# Altium project SignalAnalysis_final.PrjPCB
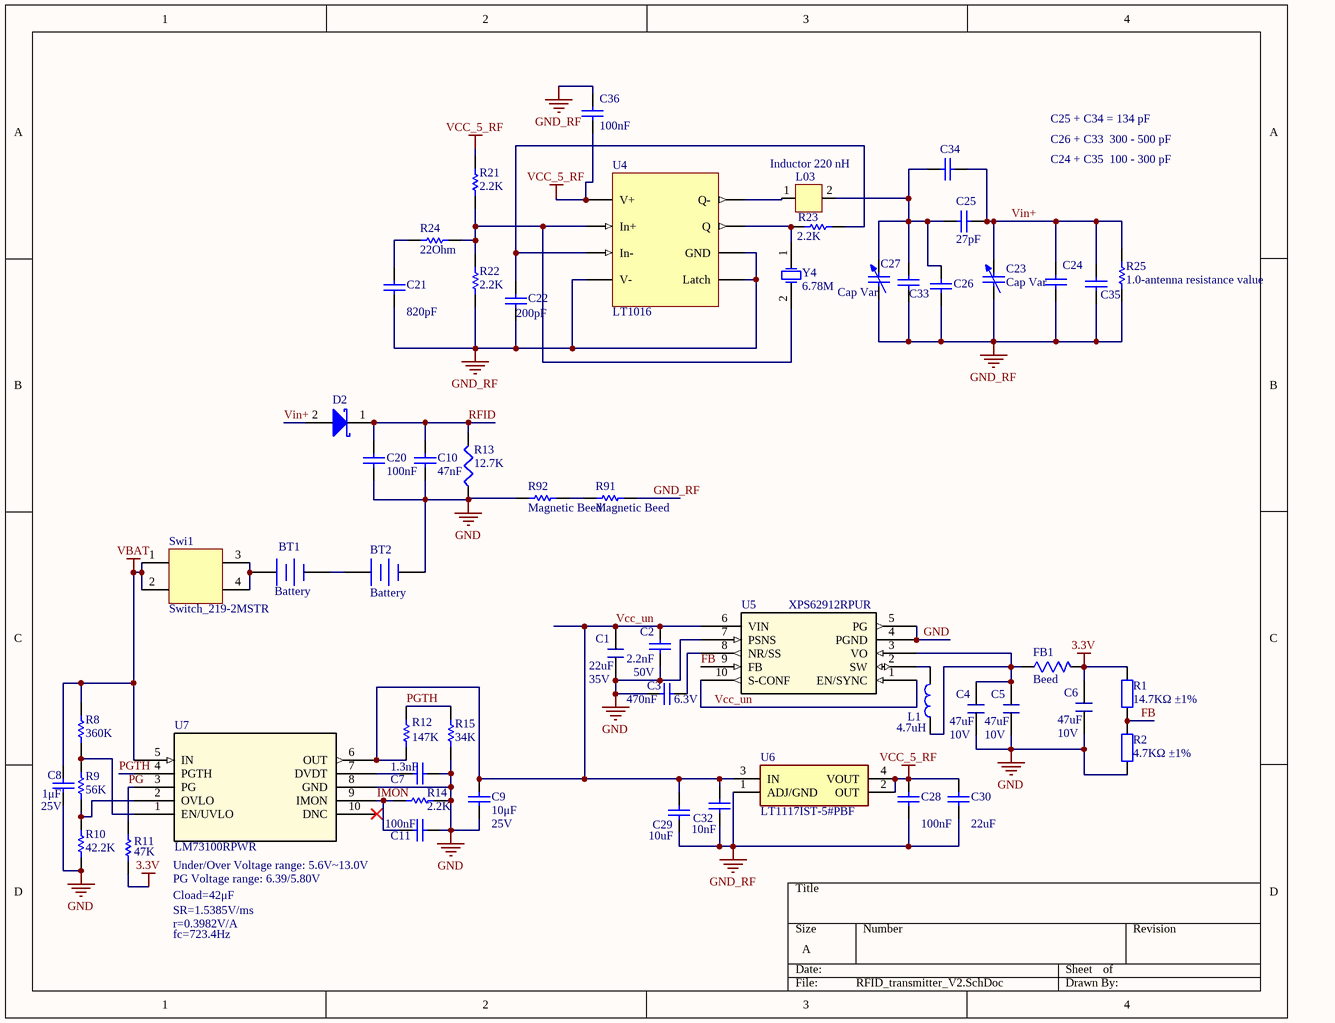
[diagram p0: RFID_transmitter_V2.SchDoc]
2 sheets, 103 parts. Net scope: global (net labels, ports and power ports of the same name join across sheets).
Board file: SignalAnalyse.PcbDoc
Sheets:
  RFID_transmitter_V2.SchDoc
  SignalAnalyse.SchDoc

## Sheet RFID_transmitter_V2.SchDoc
size A

### Parts
BT1  Battery  [Battery]
BT2  Battery  [Battery]
C1  value 22uF  Voltage: 35V  [C0805]  (hidden comment: Multilayer Ceramic Capacitor)
C2  value 2.2nF  Voltage: 50V  [0402]  (hidden comment: Cap Semi)
C3  value 470nF  Voltage: 6.3V  [1608[0603]]  (hidden comment: Cap Semi)
C4  value 47uF  Voltage: 10V  [C0805]  (hidden comment: Multilayer Ceramic Capacitor)
C5  value 47uF  Voltage: 10V  [C0805]  (hidden comment: Multilayer Ceramic Capacitor)
C6  value 47uF  Voltage: 10V  [C0805]  (hidden comment: Multilayer Ceramic Capacitor)
C7  value 1.3nF  [0402]  (hidden comment: Cap Semi)
C8  value 1μF  Voltage: 25V  [0603]  (hidden comment: Cap Semi)
C9  value 10μF  Voltage: 25V  [0603]  (hidden comment: Cap Semi)
C10  value 47nF  [0603]  (hidden comment: Cap 100n)
C11  value 100nF  [0402]  (hidden comment: Cap Semi)
C20  value 100nF  [0603]  (hidden comment: Cap 100n)
C21  value 820pF  [0603]  (hidden comment: Cap 820p)
C22  value 200pF  [0603]  (hidden comment: Cap 200p)
C23  Cap Var  [Variable_Capacitor_JZ400HV1]
C24  Cap  [0603]  (value not drawn)
C25  value 27pF  [0603]  (hidden comment: Cap)
C26  random value needs carefully address  [0603]  (value not drawn)
C27  Cap Var  [Variable_Capacitor_JZ400HV1]
C28  value 100nF  [0603]  (hidden comment: Cap 100nF)
C29  value 10uF  [0603]  (hidden comment: Cap 10u)
C30  value 22uF  [0603]  (hidden comment: Cap 22u)
C32  value 10nF  [0603]  (hidden comment: Cap 10n)
C33  random value needs carefully address  [0603]  (value not drawn)
C34  Cap  [0603]  (value not drawn)
C35  Cap  [0603]  (value not drawn)
C36  value 100nF  [C1210]  (hidden comment: C3225C0G1H104JT000N)
D2  Diode  [SOD3716X135N]  (value not drawn)
FB1  Beed  [BEADC2012X110N]
L1  value 4.7uH  [XGL4030]  (hidden comment: XGL4030)
L03  Inductor 220 nH  [Ferrite_bead_0805inch_2012mm]
R1  14.7KΩ ±1%  [LC-0402_R]
R2  4.7KΩ ±1%  [LC-0402_R]
R8  value 360K  [0402-A]  (hidden comment: Res 2.2KΩ ±1%)
R9  value 56K  [0402-A]  (hidden comment: Res 2.2KΩ ±1%)
R10  value 42.2K  [0402-A]  (hidden comment: Res 2.2KΩ ±1%)
R11  value 47K  [0402-A]  (hidden comment: Res 2.2KΩ ±1%)
R12  value 147K  [0402-A]  (hidden comment: Res 2.2KΩ ±1%)
R13  value 12.7K  [J1-0603]  (hidden comment: Res 12.7KΩ ±1%)
R14  value 2.2K  [0402-A]  (hidden comment: Res 2.2KΩ ±1%)
R15  value 34K  [0402-A]  (hidden comment: Res 2.2KΩ ±1%)
R21  value 2.2K  [J1-0603]  (hidden comment: Res 2.2KΩ ±1%)
R22  value 2.2K  [J1-0603]  (hidden comment: Res 2.2KΩ ±1%)
R23  value 2.2K  [J1-0603]  (hidden comment: Res 2.2KΩ ±1%)
R24  value 22Ohm  [J1-0603]  (hidden comment: Res 2.2KΩ ±1%)
R25  value 1.0-antenna resistance value  [J1-0603]  (hidden comment: Res 2.2KΩ ±1%)
R91  Magnetic Beed  [0603]
R92  Magnetic Beed  [0603]
Swi1  Switch_219-2MSTR  [Switch_219-2MSTR]
U4  LT1016  [LT1016_SOIC]
U5  XPS62912RPUR  [VQFN-HR10_RPU_TEX]
U6  LT1117IST-5#PBF  [SOT230P700X180-4N]
U7  LM73100RPWR  [VQFN-HR-10_2X2_TEX]
Y4  Frequency: 6.78M  [HC-49SMD]  (hidden comment: CRYSTAL)

### Nets
3.3V: C6.2 FB1.2 R1.2 R11.1
GND: BT2.2(-) C1.1 C2.1 C3.1 C4.1 C5.1 C6.1 C7.1 C8.1 C9.1 C10.2 C11.1 C20.2 R2.1 R10.1 R13.1 R14.1 R15.1 R92.2 U5.4(PGND) U5.5(PG) U5.7(PSNS) U7.8(GND)
GND_RF: C21.1 C22.1 C23.1 C24.1 C26.2 C27.1 C28.1 C29.1 C30.1 C32.1 C33.2 C35.1 C36.2 R22.1 R25.2 R91.1 U4.4(V-) U4.5(Latch) U4.6(GND) U6.1(ADJ/GND)
VBAT: C8.2 R8.2 Swi1.1(In1) Swi1.2(In2) U7.5(IN)
VCC_5_RF: C28.2 C30.2 C36.1 R21.2 U4.1(V+) U6.2(OUT) U6.4(VOUT)
FB: R1.1 R2.2 U5.9(FB)
IMON: C11.2 R14.2 U7.9(IMON)
PG: R11.2 U7.3(PG)
PGTH: R12.2 R15.2 U7.4(PGTH)
RFID: C10.1 C20.1 D2.1(ANODE) R13.2
Vcc_un: C1.2 C2.2 C9.2 C29.2 C32.2 R12.1 U5.1(EN/SYNC) U5.6(VIN) U5.10(S-CONF) U6.3(IN) U7.6(OUT)
Vin+: C23.2 C24.2 C25.1 C34.1 C35.2 D2.2(CATHODE) R25.1
NetBT1_1: BT1.1(+) Swi1.3(Out1) Swi1.4(Out2)
NetBT1_2: BT1.2(-) BT2.1(+)
NetC3_2: C3.2 U5.8(NR/SS)
NetC4_2: C4.2 C5.2 FB1.1 L1.1 U5.3(VO)
NetC7_2: C7.2 U7.7(DVDT)
NetC21_2: C21.2 R24.2
NetC22_2: C22.2 R23.1 U4.3(In-)
NetC25_2: C25.2 C26.1 C27.2 C33.1 C34.2 L03.2
NetL1_2: L1.2 U5.2(SW)
NetL03_1: L03.1 U4.8(Q-)
NetR8_1: R8.1 R9.2 U7.1(EN/UVLO)
NetR9_1: R9.1 R10.2 U7.2(OVLO)
NetR21_1: R21.1 R22.2 R24.1 U4.2(In+) Y4.2(OSC2)
NetR23_2: R23.2 U4.7(Q) Y4.1(OSC1)
NetR91_2: R91.2 R92.1

Not connected (* = marked no-connect by the designer): U7 10(DNC)*

### Notes on the sheet
- C25 + C34 = 134 pF
- C26 + C33  300 - 500 pF
- C24 + C35  100 - 300 pF
- Cload=42μF
- Under/Over Voltage range: 5.6V~13.0V
- PG Voltage range: 6.39/5.80V
- r=0.3982V/A
- fc=723.4Hz
- SR=1.5385V/ms

### Library data of the parts
BT1 BT2 = Battery: Multicell Battery; Published: 24-Mar-1999; LatestRevisionDate: 17-Jul-2002; LatestRevisionNote: Re-released for DXP Platform.; PackageReference: BAT-2; Publisher: Altium Limited; PackageDescription: Battery; 2 Leads
C1 = C-Ceramic: Part Number: C2012X5R1V226M125AC; Manufacturer: TDK
C2 = Cap Semi: Capacitor (Semiconductor SIM Model); Part Number: GRM155R71H222KA01D; Manufacturer: MuRata; Published: 8-Jun-2000; LatestRevisionDate: 29-May-2009; LatestRevisionNote: IPC-7351 Footprint Added.; PackageReference: C1206; Publisher: Altium Limited; PackageDescription: Chip Capacitor
C3 = Cap Semi: Capacitor (Semiconductor SIM Model); Manufacturer: MuRata; Part Number: GRM188R60J474KA01D; Published: 8-Jun-2000; LatestRevisionDate: 29-May-2009; LatestRevisionNote: IPC-7351 Footprint Added.; PackageReference: C1206; Publisher: Altium Limited; PackageDescription: Chip Capacitor
C4-C6 = C-Ceramic: Part Number: C2012X5R1A476M125AC; Manufacturer: TDK
C7 = Cap Semi: 多层陶瓷电容器MLCC - SMD/SMT 1.3nF 50VDC X7R 5% 0402; Part Number: GRM155R71H132JA01D; Manufacturer: MuRata; Voltage: 50V; Published: 8-Jun-2000; LatestRevisionDate: 29-May-2009; LatestRevisionNote: IPC-7351 Footprint Added.; PackageReference: C1206; Publisher: Altium Limited; PackageDescription: Chip Capacitor
C8 = Cap Semi: 多层陶瓷电容器MLCC - SMD/SMT 0603 1uF 25V X6S 10%; Manufacturer: MuRata; Part Number: GRM188C81E105KAADD; Published: 8-Jun-2000; LatestRevisionDate: 29-May-2009; LatestRevisionNote: IPC-7351 Footprint Added.; PackageReference: C1206; Publisher: Altium Limited; PackageDescription: Chip Capacitor
C9 = Cap Semi: 多层陶瓷电容器MLCC - SMD/SMT 10UF 25V 10% 0603; Manufacturer: MuRata; Part Number: GRM188R61E106KA73D; Published: 8-Jun-2000; LatestRevisionDate: 29-May-2009; LatestRevisionNote: IPC-7351 Footprint Added.; PackageReference: C1206; Publisher: Altium Limited; PackageDescription: Chip Capacitor
C10 = Cap Semi: Capacitor; Part Number: CL10B473KB8NNNC; Manufacturer: SAMSUNG; Voltage: 50V; Published: 8-Jun-2000; LatestRevisionDate: 29-May-2009; LatestRevisionNote: IPC-7351 Footprint Added.; PackageReference: C1206; Publisher: Altium Limited; PackageDescription: Chip Capacitor
C11 = Cap Semi: 多层陶瓷电容器MLCC - SMD/SMT 100nF 10VDC X5R 5% 0402; Part Number: GRM155R61A104JA01D; Manufacturer: MuRata; Voltage: 10V; Published: 8-Jun-2000; LatestRevisionDate: 29-May-2009; LatestRevisionNote: IPC-7351 Footprint Added.; PackageReference: C1206; Publisher: Altium Limited; PackageDescription: Chip Capacitor
C20 = Cap Semi: Capacitor; Part Number: CL10B104KB8NNNC; Manufacturer: SAMSUNG; Voltage: 50V; Published: 8-Jun-2000; LatestRevisionDate: 29-May-2009; LatestRevisionNote: IPC-7351 Footprint Added.; PackageReference: C1206; Publisher: Altium Limited; PackageDescription: Chip Capacitor
C21 C22 C30 C32 = Cap: Capacitor; Published: 8-Jun-2000; LatestRevisionDate: 17-Jul-2002; LatestRevisionNote: Re-released for DXP Platform.; PackageReference: RAD-0.3; Publisher: Altium Limited; PackageDescription: Radial Cap, Thru-Hole; 2 Leads; 0.3 in Pin Spacing
C23 C27 = Cap Var: Variable or Adjustable Capacitor; Value: 100pF; Published: 24-Mar-1999; LatestRevisionDate: 29-May-2009; LatestRevisionNote: IPC-7351 Footprint Added.; PackageReference: C1210; Publisher: Altium Limited; PackageDescription: Chip Capacitor 1210 Case Size; Code_JEITA: 1210; Code_IPC: CAPC3225
C24 = Cap: Capacitor_for resonance; Value: 22pF; Published: 8-Jun-2000; LatestRevisionDate: 17-Jul-2002; LatestRevisionNote: Re-released for DXP Platform.; PackageReference: RAD-0.3; Publisher: Altium Limited; PackageDescription: Radial Cap, Thru-Hole; 2 Leads; 0.3 in Pin Spacing
C25 = Cap: Capacitor_for resonance; Published: 8-Jun-2000; LatestRevisionDate: 17-Jul-2002; LatestRevisionNote: Re-released for DXP Platform.; PackageReference: RAD-0.3; Publisher: Altium Limited; PackageDescription: Radial Cap, Thru-Hole; 2 Leads; 0.3 in Pin Spacing
C26 = Cap: Capacitor_for resonance; Value: 470pF; Published: 8-Jun-2000; LatestRevisionDate: 17-Jul-2002; LatestRevisionNote: Re-released for DXP Platform.; PackageReference: RAD-0.3; Publisher: Altium Limited; PackageDescription: Radial Cap, Thru-Hole; 2 Leads; 0.3 in Pin Spacing
C28 = Cap: 多层陶瓷电容器MLCC - SMD/SMT 0.1UF 16V 10% 0603; Part Number: GCM188R71C104KA37J; Published: 8-Jun-2000; LatestRevisionDate: 17-Jul-2002; LatestRevisionNote: Re-released for DXP Platform.; PackageReference: RAD-0.3; Publisher: Altium Limited; PackageDescription: Radial Cap, Thru-Hole; 2 Leads; 0.3 in Pin Spacing; Voltage: 16V
C29 = Cap: Capacitor; Part Number: GRM188R61E106KA73D; Manufacturer: Murata; Voltage: 25V; Published: 8-Jun-2000; LatestRevisionDate: 17-Jul-2002; LatestRevisionNote: Re-released for DXP Platform.; PackageReference: RAD-0.3; Publisher: Altium Limited; PackageDescription: Radial Cap, Thru-Hole; 2 Leads; 0.3 in Pin Spacing
C33-C35 = Cap: Capacitor_for resonance; Value: 1pF; Published: 8-Jun-2000; LatestRevisionDate: 17-Jul-2002; LatestRevisionNote: Re-released for DXP Platform.; PackageReference: RAD-0.3; Publisher: Altium Limited; PackageDescription: Radial Cap, Thru-Hole; 2 Leads; 0.3 in Pin Spacing
C36 = Cap Semi: Capacitor (Semiconductor SIM Model); Manufacturer: TDK; Voltage: 10V; Published: 8-Jun-2000; LatestRevisionDate: 29-May-2009; LatestRevisionNote: IPC-7351 Footprint Added.; PackageReference: C1206; Publisher: Altium Limited; PackageDescription: Chip Capacitor; Part Number: C3225C0G1H104JT000N
D2 = MBR0540T1G: Surface Mount Schottky Power Rectifier; Manufacturer_Name: ON Semiconductor; Datasheet Link: http://www.onsemi.com/pub/Collateral/MBR0540T1-D.PDF; Height: 1.35mm; Manufacturer_Part_Number: MBR0540T1G; Arrow Part Number: MBR0540T1G; Arrow Price/Stock: https://www.arrow.com/en/products/mbr0540t1g/on-semiconductor; Mouser Part Number: 863-MBR0540T1G; Mouser Price/Stock: https://www.mouser.co.uk/ProductDetail/ON-Semiconductor/MBR0540T1G?qs=3JMERSakebqeY0cO5%252BUPCQ%3D%3D
FB1 = 782853200: Wurth Ferrite Bead; Manufacturer_Name: Wurth Elektronik; Datasheet Link: http://katalog.we-online.de/pbs/datasheet/782853200.pdf; Height: 1.1mm; Manufacturer_Part_Number: 782853200
L1 = Inductor: Coilcraft Shielded Power Inductors; Part Number: XGL4030-472MEC; Manufacturer: Coilcraft
L03 = Component_1: 220nH
R1 = 0402 1KΩ (1001) 1%: 贴片电阻; Part Number: CRCW040214K7FKED; Manufacturer: Vishay-Dale; ComponentLink1Description: 供应商链接; ComponentLink1URL: http://www.szlcsc.com/product/details_12256.html; Package: 0402
R2 = 0402 1KΩ (1001) 1%: 贴片电阻; Part Number: CRCW04024K70FKED; Manufacturers: Vishay-Dale; ComponentLink1Description: 供应商链接; ComponentLink1URL: http://www.szlcsc.com/product/details_12256.html; Package: 0402
R8 = Res1: Resistor; Part Number: RC0402FR-07360KL; Manufacturer: YAGEO; Published: 8-Jun-2000; LatestRevisionDate: 17-Jul-2002; LatestRevisionNote: Re-released for DXP Platform.; PackageReference: AXIAL-0.3; Publisher: Altium Limited; PackageDescription: Axial Device, Thru-Hole; 2 Leads; 0.3 in Pin Spacing
R9 = Res1: Resistor; Part Number: RC0402FR-0756KL; Manufacturer: YAGEO; Published: 8-Jun-2000; LatestRevisionDate: 17-Jul-2002; LatestRevisionNote: Re-released for DXP Platform.; PackageReference: AXIAL-0.3; Publisher: Altium Limited; PackageDescription: Axial Device, Thru-Hole; 2 Leads; 0.3 in Pin Spacing
R10 R21-R23 = Res1: Resistor; Part Number: RC0603FR-072K2L; Manufacturer: YAGEO; Published: 8-Jun-2000; LatestRevisionDate: 17-Jul-2002; LatestRevisionNote: Re-released for DXP Platform.; PackageReference: AXIAL-0.3; Publisher: Altium Limited; PackageDescription: Axial Device, Thru-Hole; 2 Leads; 0.3 in Pin Spacing
R11 = Res1: Resistor; Part Number: RC0402FR-0747KL; Manufacturer: YAGEO; Published: 8-Jun-2000; LatestRevisionDate: 17-Jul-2002; LatestRevisionNote: Re-released for DXP Platform.; PackageReference: AXIAL-0.3; Publisher: Altium Limited; PackageDescription: Axial Device, Thru-Hole; 2 Leads; 0.3 in Pin Spacing
R12 = Res1: Resistor; Part Number: RC0402FR-07147KL; Manufacturer: YAGEO; Published: 8-Jun-2000; LatestRevisionDate: 17-Jul-2002; LatestRevisionNote: Re-released for DXP Platform.; PackageReference: AXIAL-0.3; Publisher: Altium Limited; PackageDescription: Axial Device, Thru-Hole; 2 Leads; 0.3 in Pin Spacing
R13 = Res3: Resistor; Part Number: RC0603FR-0712K7L; Manufacturer: YAGEO; Published: 8-Jun-2000; LatestRevisionDate: 29-May-2009; LatestRevisionNote: IPC-7351 Footprint Added.; PackageReference: J1-0603; Publisher: Altium Limited; PackageDescription: Chip Resistor
R14 = Res1: Resistor; Part Number: RC0402FR-072K2L; Manufacturer: YAGEO; Published: 8-Jun-2000; LatestRevisionDate: 17-Jul-2002; LatestRevisionNote: Re-released for DXP Platform.; PackageReference: AXIAL-0.3; Publisher: Altium Limited; PackageDescription: Axial Device, Thru-Hole; 2 Leads; 0.3 in Pin Spacing
R15 = Res1: Resistor; Part Number: RC0402FR-0734KL; Manufacturer: YAGEO; Published: 8-Jun-2000; LatestRevisionDate: 17-Jul-2002; LatestRevisionNote: Re-released for DXP Platform.; PackageReference: AXIAL-0.3; Publisher: Altium Limited; PackageDescription: Axial Device, Thru-Hole; 2 Leads; 0.3 in Pin Spacing
R24 = Res1: Resistor; Part Number: RC0603FR-0722RL; Manufacturer: YAGEO; Published: 8-Jun-2000; LatestRevisionDate: 17-Jul-2002; LatestRevisionNote: Re-released for DXP Platform.; PackageReference: AXIAL-0.3; Publisher: Altium Limited; PackageDescription: Axial Device, Thru-Hole; 2 Leads; 0.3 in Pin Spacing
R25 = Res1: Resistor; Part Number: RC0603FR-071RL; Manufacturer: YAGEO; Published: 8-Jun-2000; LatestRevisionDate: 17-Jul-2002; LatestRevisionNote: Re-released for DXP Platform.; PackageReference: AXIAL-0.3; Publisher: Altium Limited; PackageDescription: Axial Device, Thru-Hole; 2 Leads; 0.3 in Pin Spacing
R91 R92 = Res1: Wurth Magnetic Bead; Value: 0; Published: 8-Jun-2000; LatestRevisionDate: 17-Jul-2002; LatestRevisionNote: Re-released for DXP Platform.; PackageReference: AXIAL-0.3; Publisher: Altium Limited; PackageDescription: Axial Device, Thru-Hole; 2 Leads; 0.3 in Pin Spacing
U5 = XPS62912RPUR: No Description Available; Vendor: Texas Instruments; Built_By: EMA_Cory; SourceLibrary: TI_2020-08-27; Datasheet: https://www.ti.com/lit/ds/symlink/tps62913.pdf?ts=1598546293590&ref_url=https%253A%252F%252Fwww.ti.com%252Fproduct%252FTPS62913; Manufacturer_Part_Number: XPS62912RPUR; Copyright: Copyright (C) 2018 Accelerated Designs. All rights reserved; RefDes: RefDes; Type: DEV
U7 = LM73100RPWR: No Description Available; Vendor: Texas Instruments; Built_By: EMA_Anthony; SourceLibrary: Add_to_database_2020-10-23; Datasheet: https://www.ti.com/lit/ds/symlink/lm7310.pdf?ts=1603393347029&ref_url=https%253A%252F%252Fwww.ti.com%252Fproduct%252FLM7310%253FHQS%253DTI-null-null-octopart-df-pf-null-wwe; Manufacturer_Part_Number: LM73100RPWR; Copyright: Copyright (C) 2018 Accelerated Designs. All rights reserved; RefDes: RefDes; Type: DEV
Y4 = CRYSTAL: Industry standard SMD crystal; Part Number: LFXTAL057410Bulk; Manufacturer: IQD

## Sheet SignalAnalyse.SchDoc
size A4
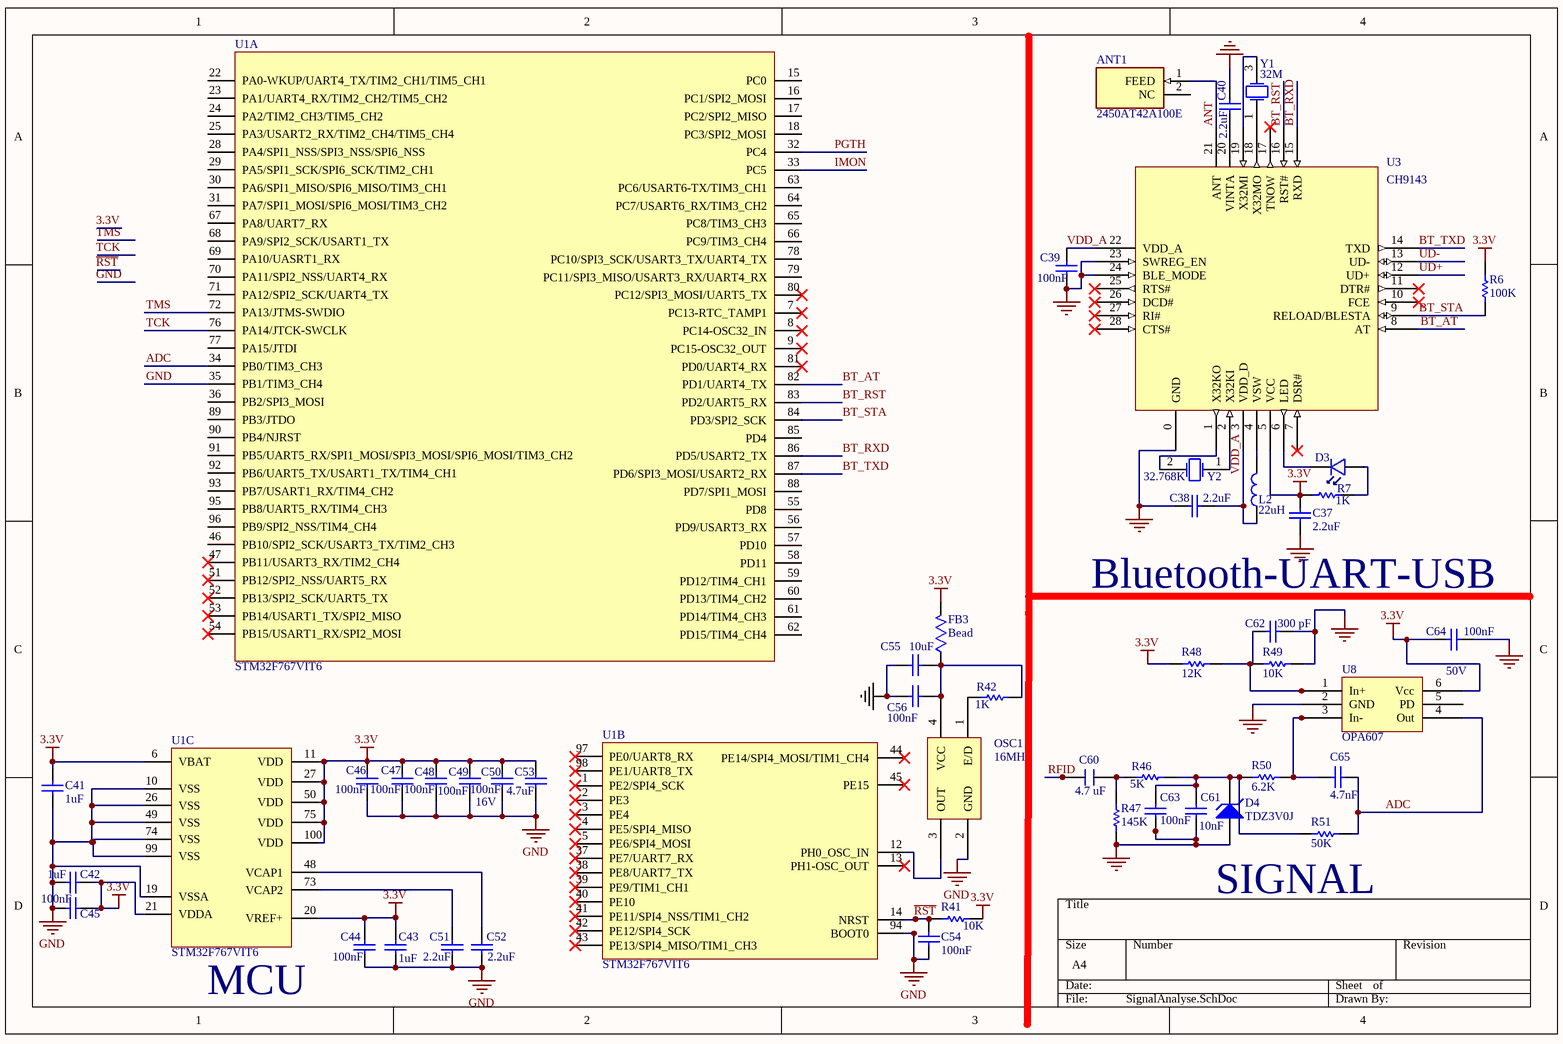
[diagram p1: SignalAnalyse.SchDoc]

### Parts
ANT1  2450AT42A100E  [ANTC5020X110N]
C37  value 2.2uF  [0603]  (hidden comment: GRM188R61A226ME15D)
C38  value 2.2uF  [0603]  (hidden comment: GRM188R61A226ME15D)
C39  value 100nF  [1608[0603]]  (hidden comment: Cap 100nF)
C40  value 2.2uF  [1608[0603]]  (hidden comment: GRM188R61A226ME15D)
C41  value 1uF  [1608[0603]]  (hidden comment: GRM188R61A226ME15D)
C42  value 1uF  [1608[0603]]  (hidden comment: GRM188R61A226ME15D)
C43  value 1uF  [1608[0603]]  (hidden comment: GRM188R61A226ME15D)
C44  value 100nF  [1608[0603]]  (hidden comment: Cap 100nF)
C45  value 100nF  [1608[0603]]  (hidden comment: Cap 100nF)
C46  value 100nF  [1608[0603]]  (hidden comment: Cap 100nF)
C47  value 100nF  [1608[0603]]  (hidden comment: Cap 100nF)
C48  value 100nF  [1608[0603]]  (hidden comment: Cap 100nF)
C49  value 100nF  [1608[0603]]  (hidden comment: Cap 100nF)
C50  value 100nF  Voltage: 16V  [1608[0603]]  (hidden comment: Cap 100nF)
C51  value 2.2uF  [1608[0603]]  (hidden comment: GRM188R61A226ME15D)
C52  value 2.2uF  [1608[0603]]  (hidden comment: GRM188R61A226ME15D)
C53  value 4.7uF  [1608[0603]]  (hidden comment: GRM188R61A226ME15D)
C54  value 100nF  [1608[0603]]  (hidden comment: Cap 100nF)
C55  value 10uF  [1608[0603]]  (hidden comment: Cap 10μF)
C56  value 100nF  [1608[0603]]  (hidden comment: Cap 100nF)
C60  value 4.7 uF  [0603]  (hidden comment: Cap 4.7μF)
C61  value 10nF  [1608[0603]]  (hidden comment: Cap 10n)
C62  value 300 pF  [1608[0603]]  (hidden comment: Cap 300pF)
C63  value 100nF  [1608[0603]]  (hidden comment: Cap 100nF)
C64  value 100nF  Voltage: 50V  [1608[0603]]  (hidden comment: Cap 100nF)
C65  value 4.7nF  [1608[0603]]  (hidden comment: Cap 4.7nF)
D3  LED-Green  [D0805]  (value not drawn)
D4  TDZ3V0J  [SOD-323]
FB3  Bead  [BEADC2012X110N]
L2  22uH  [L0805]
OSC1  16MHz  [OSC_3.2X2.5]
R6  value 100K  [J1-0603]  (hidden comment: Res 2.2KΩ ±1%)
R7  value 1K  [J1-0603]  (hidden comment: Res 2.2KΩ ±1%)
R41  value 10K  [J1-0603]  (hidden comment: Res 2.2KΩ ±1%)
R42  value 1K  [J1-0603]  (hidden comment: Res 2.2KΩ ±1%)
R46  value 5K  [J1-0603]
R47  value 145K  [J1-0603]
R48  value 12K  [J1-0603]
R49  value 10K  [J1-0603]
R50  value 6.2K  [J1-0603]
R51  value 50K  [J1-0603]
U1  STM32F767VIT6  [STM32F767VIT6]  (parts A,B,C of 3)
U3  CH9143  [QFN28_4X4]
U8  OPA607  [OPA607IDCKR]
Y1  32M  [SMD2016-4N]
Y2  32.768K  [Q13FC1350000400]

### Nets
3.3V: C37.2 C41.1 C42.1 C43.2 C44.2 C45.1 C46.2 C47.2 C48.2 C49.2 C50.2 C53.2 C64.2 FB3.2 R6.1 R7.1 R41.2 R48.2 U1.6(VBAT) U1.11(VDD) U1.20(VREF+) U1.21(VDDA) U1.27(VDD) U1.50(VDD) U1.75(VDD) U1.100(VDD) U3.5(VCC) U8.6(Vcc)
GND: C37.1 C38.1 C39.2 C40.1 C41.2 C42.2 C43.1 C44.1 C45.2 C46.1 C47.1 C48.1 C49.1 C50.1 C51.1 C52.1 C53.1 C54.2 C55.2 C56.2 C61.1 C62.1 C63.1 C64.1 D4.1(A) OSC1.2(GND) R47.2 R49.2 U1.10(VSS) U1.19(VSSA) U1.26(VSS) U1.35(PB1/TIM3_CH4) U1.49(VSS) U1.74(VSS) U1.94(BOOT0) U1.99(VSS) U3.0(GND) U3.23(SWREG_EN) U3.24(BLE_MODE) U8.2(GND)
ADC: C65.1 R51.1 U1.34(PB0/TIM3_CH3) U8.4(Out)
ANT: ANT1.1(FEED) U3.21(ANT)
BT_AT: U1.82(PD1/UART4_TX) U3.8(AT)
BT_RST: U1.83(PD2/UART5_RX) U3.16(RST#)
BT_RXD: U1.86(PD5/USART2_TX) U3.15(RXD)
BT_STA: R6.2 U1.84(PD3/SPI2_SCK) U3.9(RELOAD/BLESTA)
BT_TXD: U1.87(PD6/SPI3_MOSI/USART2_RX) U3.14(TXD)
IMON: U1.33(PC5)
PGTH: U1.32(PC4)
~{RST}: C54.1 R41.1 U1.14(NRST)
RFID: C60.1
TCK: U1.76(PA14/JTCK-SWCLK)
TMS: U1.72(PA13/JTMS-SWDIO)
UD+: U3.12(UD+)
UD-: U3.13(UD-)
VDD_A: C38.2 C39.1 L2.1 U3.3(VDD_D) U3.22(VDD_A)
NetC40_2: C40.2 U3.20(VINTA)
NetC51_2: C51.2 U1.73(VCAP2)
NetC52_2: C52.2 U1.48(VCAP1)
NetC55_1: C55.1 C56.1 FB3.1 OSC1.4(VCC) R42.2
NetC60_2: C60.2 R46.1 R47.1
NetC61_2: C61.2 C63.2 D4.2(K) R46.2 R50.2 R51.2
NetC62_2: C62.2 R48.1 R49.1 U8.1(In+)
NetC65_2: C65.2 R50.1 U8.3(In-)
NetD3_1: D3.1 R7.2
NetD3_2: D3.2 U3.6(LED)
NetL2_2: L2.2 U3.4(VSW)
NetOSC1_1: OSC1.1(E/D) R42.1
NetOSC1_3: OSC1.3(OUT) U1.12(PH0_OSC_IN)
NetU3_1: U3.1(X32KO) Y2.2(CRYSTAL_2)
NetU3_2: U3.2(X32KI) Y2.1(CRYSTAL_1)
NetU3_18: U3.18(X32MO) Y1.1(OSC1)
NetU3_19: U3.19(X32MI) Y1.3(OSC2)

Not connected (* = marked no-connect by the designer): ANT1 2(NC); U1 1(PE2/SPI4_SCK)* 2(PE3)* 3(PE4)* 4(PE5/SPI4_MISO)* 5(PE6/SPI4_MOSI)* 7(PC13-RTC_TAMP1)* 8(PC14-OSC32_IN)* 9(PC15-OSC32_OUT)* 13(PH1-OSC_OUT)* 15(PC0) 16(PC1/SPI2_MOSI) 17(PC2/SPI2_MISO) 18(PC3/SPI2_MOSI) 22(PA0-WKUP/UART4_TX/TIM2_CH1/TIM5_CH1) 23(PA1/UART4_RX/TIM2_CH2/TIM5_CH2) 24(PA2/TIM2_CH3/TIM5_CH2) 25(PA3/USART2_RX/TIM2_CH4/TIM5_CH4) 28(PA4/SPI1_NSS/SPI3_NSS/SPI6_NSS) 29(PA5/SPI1_SCK/SPI6_SCK/TIM2_CH1) 30(PA6/SPI1_MISO/SPI6_MISO/TIM3_CH1) 31(PA7/SPI1_MOSI/SPI6_MOSI/TIM3_CH2) 36(PB2/SPI3_MOSI) 37(PE7/UART7_RX)* 38(PE8/UART7_TX)* 39(PE9/TIM1_CH1)* 40(PE10)* 41(PE11/SPI4_NSS/TIM1_CH2)* 42(PE12/SPI4_SCK)* 43(PE13/SPI4_MISO/TIM1_CH3)* 44(PE14/SPI4_MOSI/TIM1_CH4)* 45(PE15)* 46(PB10/SPI2_SCK/USART3_TX/TIM2_CH3) 47(PB11/USART3_RX/TIM2_CH4)* 51(PB12/SPI2_NSS/UART5_RX)* 52(PB13/SPI2_SCK/UART5_TX)* 53(PB14/USART1_TX/SPI2_MISO)* 54(PB15/USART1_RX/SPI2_MOSI)* 55(PD8) 56(PD9/USART3_RX) 57(PD10) 58(PD11) 59(PD12/TIM4_CH1) 60(PD13/TIM4_CH2) 61(PD14/TIM4_CH3) 62(PD15/TIM4_CH4) 63(PC6/USART6-TX/TIM3_CH1) 64(PC7/USART6_RX/TIM3_CH2) 65(PC8/TIM3_CH3) 66(PC9/TIM3_CH4) 67(PA8/UART7_RX) 68(PA9/SPI2_SCK/USART1_TX) 69(PA10/UASRT1_RX) 70(PA11/SPI2_NSS/UART4_RX) 71(PA12/SPI2_SCK/UART4_TX) 77(PA15/JTDI) 78(PC10/SPI3_SCK/USART3_TX/UART4_TX) 79(PC11/SPI3_MISO/USART3_RX/UART4_RX) 80(PC12/SPI3_MOSI/UART5_TX)* 81(PD0/UART4_RX)* 85(PD4) 88(PD7/SPI1_MOSI) 89(PB3/JTDO) 90(PB4/NJRST) 91(PB5/UART5_RX/SPI1_MOSI/SPI3_MOSI/SPI6_MOSI/TIM3_CH2) 92(PB6/UART5_TX/USART1_TX/TIM4_CH1) 93(PB7/USART1_RX/TIM4_CH2) 95(PB8/UART5_RX/TIM4_CH3) 96(PB9/SPI2_NSS/TIM4_CH4) 97(PE0/UART8_RX)* 98(PE1/UART8_TX)*; U3 7(DSR#)* 10(FCE)* 11(DTR#)* 17(TNOW)* 25(RTS#)* 26(DCD#)* 27(RI#)* 28(CTS#)*; U8 5(PD)

### Notes on the sheet
- Bluetooth-UART-USB
- (near R51) SIGNAL
- (near U1) MCU
- Labels drawn without touching a wire or pin: 3.3V, GND, TCK, TMS, ~{RST}

### Library data of the parts
ANT1 = 2450AT42A100E: Antenna; Manufacturer_Name: JOHANSON TECHNOLOGY; Datasheet Link: https://mouser.componentsearchengine.com/Datasheets/2/2450AT42A100E.pdf; Height: 1.1mm; Manufacturer_Part_Number: 2450AT42A100E; Mouser Part Number: 609-2450AT42A100E; Mouser Price/Stock: https://www.mouser.co.uk/ProductDetail/Johanson-Technology/2450AT42A100E/?qs=yCnrNFeXz%252BhaJmvBFFPWJQ%3D%3D; Arrow Part Number: 2450AT42A100E; Arrow Price/Stock: https://www.arrow.com/en/products/2450at42a100e/johanson-dielectrics
C37 C38 C40 C53 = Cap Semi: Capacitor (Semiconductor SIM Model); Voltage: 10V; Published: 8-Jun-2000; LatestRevisionDate: 29-May-2009; LatestRevisionNote: IPC-7351 Footprint Added.; PackageReference: C1206; Publisher: Altium Limited; PackageDescription: Chip Capacitor
C39 C44-C50 C54 C56 = Cap Semi: 多层陶瓷电容器MLCC - SMD/SMT 0.1UF 16V 10% 0603; Part Number: GCM188R71C104KA37J; Published: 8-Jun-2000; LatestRevisionDate: 29-May-2009; LatestRevisionNote: IPC-7351 Footprint Added.; PackageReference: C1206; Publisher: Altium Limited; PackageDescription: Chip Capacitor
  C39 C44-C49 C54 C56: Voltage: 16V
C41-C43 = Cap Semi: Capacitor (Semiconductor SIM Model); Voltage: 50V; Published: 8-Jun-2000; LatestRevisionDate: 29-May-2009; LatestRevisionNote: IPC-7351 Footprint Added.; PackageReference: C1206; Publisher: Altium Limited; PackageDescription: Chip Capacitor
C51 C52 = Cap Semi: Capacitor (Semiconductor SIM Model); Voltage: 16V; Published: 8-Jun-2000; LatestRevisionDate: 29-May-2009; LatestRevisionNote: IPC-7351 Footprint Added.; PackageReference: C1206; Publisher: Altium Limited; PackageDescription: Chip Capacitor
C55 = Cap Semi: 多层陶瓷电容器MLCC - SMD/SMT 10UF 25V 10% 0603; Part Number: GRM188R61E106KA73D; Manufacturer: Murata; Published: 8-Jun-2000; LatestRevisionDate: 29-May-2009; LatestRevisionNote: IPC-7351 Footprint Added.; PackageReference: C1206; Publisher: Altium Limited; PackageDescription: Chip Capacitor; Voltage: 25V
C60 = C-Ceramic: 多层陶瓷电容器MLCC - SMD/SMT 0603 4.7uF 25V X5R 20%; Part Number: GRM188R61E475ME11J; Voltage: 25V
C61 = Cap Semi: 多层陶瓷电容器MLCC - SMD/SMT 0.01UF 25V 5% 0603 C0G; Part Number: GRM1885C1E103JA01D; Published: 8-Jun-2000; LatestRevisionDate: 29-May-2009; LatestRevisionNote: IPC-7351 Footprint Added.; PackageReference: C0603; Publisher: Altium Limited; PackageDescription: Chip Capacitor; Voltage: 25V
C62 = Cap Semi: 多层陶瓷电容器MLCC - SMD/SMT 0603 300pF 50volts C0G 2%; Part Number: GRM1885C1H301GA01D; Voltage: 50V; Published: 8-Jun-2000; LatestRevisionDate: 29-May-2009; LatestRevisionNote: IPC-7351 Footprint Added.; PackageReference: C0603; Publisher: Altium Limited; PackageDescription: Chip Capacitor
C63 = Cap Semi: 多层陶瓷电容器MLCC - SMD/SMT 100nF+/-10% 50V X7R 1608; Part Number: CL10B104KB8NNNC; Published: 8-Jun-2000; LatestRevisionDate: 29-May-2009; LatestRevisionNote: IPC-7351 Footprint Added.; PackageReference: C0603; Publisher: Altium Limited; PackageDescription: Chip Capacitor; Voltage: 50V
C64 = Cap Semi: 多层陶瓷电容器MLCC - SMD/SMT 100nF+/-10% 50V X7R 1608; Part Number: GCM188R71C104KA37J; Published: 8-Jun-2000; LatestRevisionDate: 29-May-2009; LatestRevisionNote: IPC-7351 Footprint Added.; PackageReference: C0603; Publisher: Altium Limited; PackageDescription: Chip Capacitor
C65 = Cap Semi: 多层陶瓷电容器MLCC - SMD/SMT 16V 4700pF X7R 0603 10%; Part Number: CC0603KRX7R7BB472; Manufacture: YAGEO; Published: 8-Jun-2000; LatestRevisionDate: 29-May-2009; LatestRevisionNote: IPC-7351 Footprint Added.; PackageReference: C0603; Publisher: Altium Limited; PackageDescription: Chip Capacitor; Voltage: 16V
D3 = LED
D4 = D Zener: Zener Diode 3V; Published: 8-Jun-2000; LatestRevisionDate: 17-Jul-2002; LatestRevisionNote: Re-released for DXP Platform.; PackageReference: DIODE-0.7; Publisher: Altium Limited; PackageDescription: Diode, Thru-Hole; 2 Leads; 0.7 in Pin Spacing
FB3 = 782853200: as FB1 on sheet RFID_transmitter_V2; Datasheet Link: http://katalog.we-online.de/pbs/datasheet/782853200.pdf; Height: 1.1mm; Manufacturer_Part_Number: 782853200
L2 = FB: Part Number: MGFL2012F220; Manufacturer: microgate; Value: 22uH
OSC1 = OSC2: OSC with disable function
R6 = Res1: Resistor; Part Number: RC0603FR-07100KL; Manufacturer: YAGEO; Published: 8-Jun-2000; LatestRevisionDate: 17-Jul-2002; LatestRevisionNote: Re-released for DXP Platform.; PackageReference: AXIAL-0.3; Publisher: Altium Limited; PackageDescription: Axial Device, Thru-Hole; 2 Leads; 0.3 in Pin Spacing
R7 R42 R46 = Res1: Resistor; Part Number: RC0603FR-071KL; Manufacturer: YAGEO; Published: 8-Jun-2000; LatestRevisionDate: 17-Jul-2002; LatestRevisionNote: Re-released for DXP Platform.; PackageReference: AXIAL-0.3; Publisher: Altium Limited; PackageDescription: Axial Device, Thru-Hole; 2 Leads; 0.3 in Pin Spacing
R41 R47-R51 = Res1: Resistor; Part Number: RC0603FR-0710KL; Manufacturer: YAGEO; Published: 8-Jun-2000; LatestRevisionDate: 17-Jul-2002; LatestRevisionNote: Re-released for DXP Platform.; PackageReference: AXIAL-0.3; Publisher: Altium Limited; PackageDescription: Axial Device, Thru-Hole; 2 Leads; 0.3 in Pin Spacing
U3 = CH9143: Bluetooth-LowEnergy & UART & USB Mutual Transport
U8 = TSV620AILT
Y1 = X201632MMB4SI: Quartz Crystal Oscillator; Manufacturer_Name: Yangxing Tech; Datasheet Link: https://datasheet.lcsc.com/szlcsc/1904031205_Yangxing-Tech-X201632MMB4SI_C383840.pdf; Height: 0.5mm; Manufacturer_Part_Number: X201632MMB4SI
Y2 = Q13FC1350000400: Crystal Oscillator; Manufacturer_Name: SEIKO EPSON; Datasheet Link: https://datasheet.lcsc.com/szlcsc/1901081604_Seiko-Epson-Q13FC1350000400_C32346.pdf; Height: 0.9mm; Manufacturer_Part_Number: Q13FC1350000400

## Nets that join several sheets
3.3V: RFID_transmitter_V2 (C6.2 FB1.2 R1.2 R11.1), SignalAnalyse (28 pins)
GND: RFID_transmitter_V2 (23 pins), SignalAnalyse (40 pins)
IMON: RFID_transmitter_V2 (C11.2 R14.2 U7.9), SignalAnalyse (U1.33)
PGTH: RFID_transmitter_V2 (R12.2 R15.2 U7.4), SignalAnalyse (U1.32)
RFID: RFID_transmitter_V2 (C10.1 C20.1 D2.1 R13.2), SignalAnalyse (C60.1)